# EAGLE schematic ohms-law-1 (EAGLE 7.7.0)
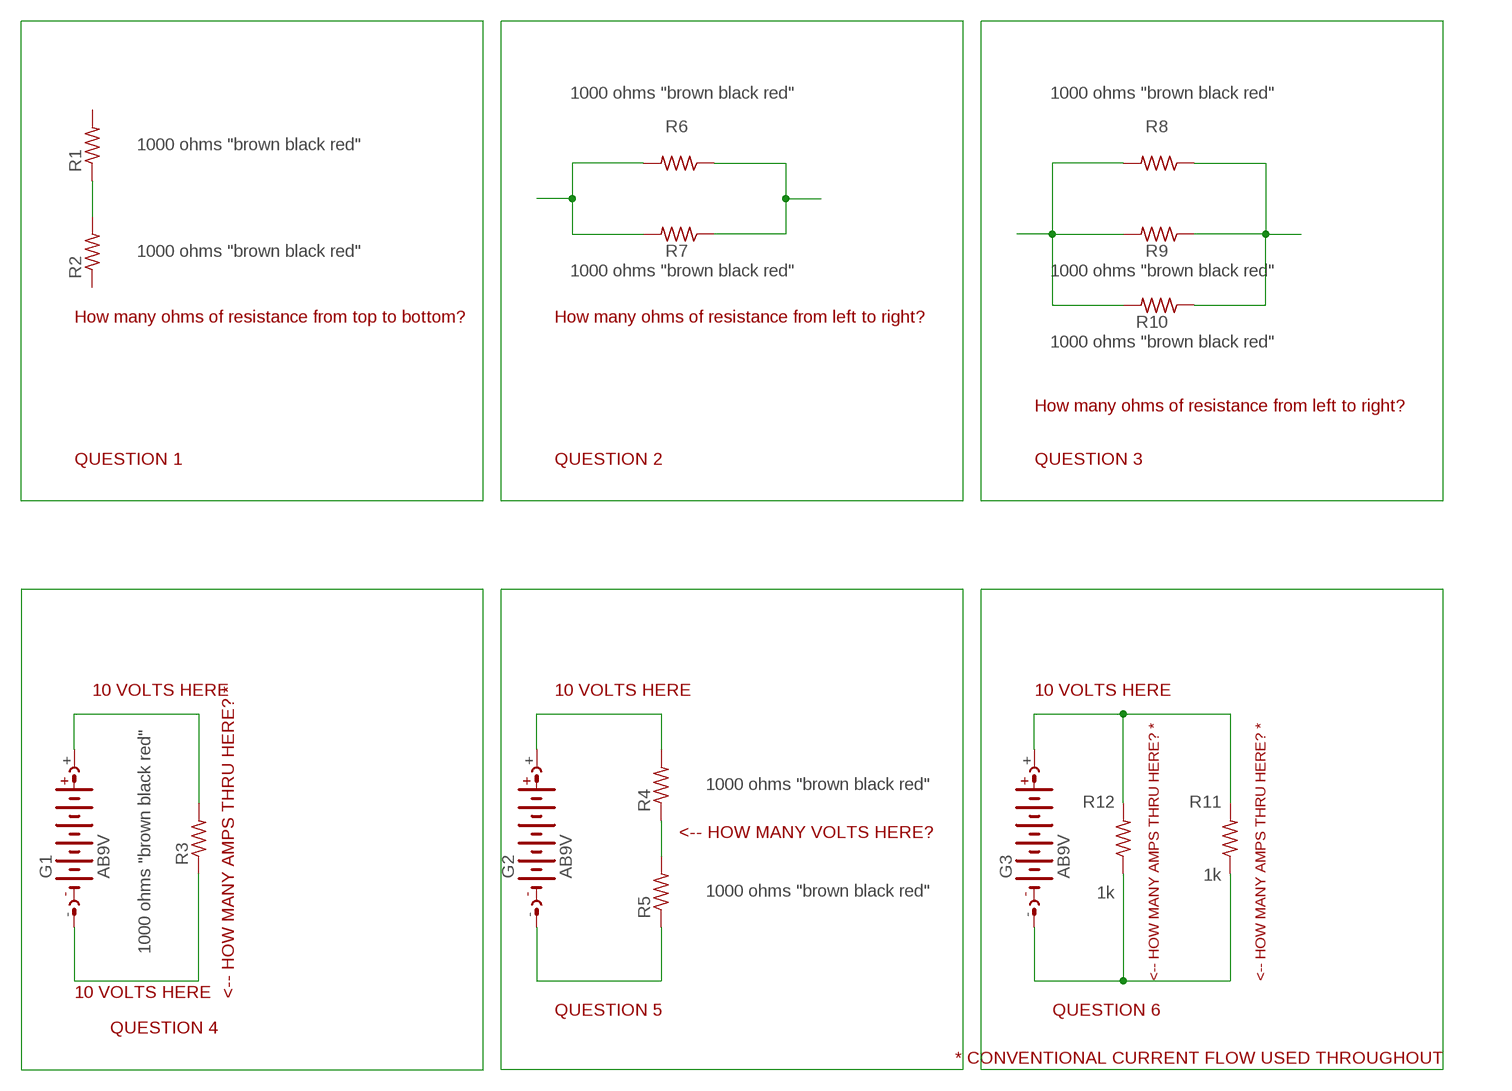
[diagram p0: schematic, sheet 1]

## Parts
G1  AB9V  [AB9V]
G2  AB9V  [AB9V]
G3  AB9V  [AB9V]
R1  1000 ohms "brown black red"  R-US_M0805  [M0805]
R2  1000 ohms "brown black red"  R-US_M0805  [M0805]
R3  1000 ohms "brown black red"  R-US_M0805  [M0805]
R4  1000 ohms "brown black red"  R-US_M0805  [M0805]
R5  1000 ohms "brown black red"  R-US_M0805  [M0805]
R6  1000 ohms "brown black red"  R-US_M0805  [M0805]
R7  1000 ohms "brown black red"  R-US_M0805  [M0805]
R8  1000 ohms "brown black red"  R-US_M0805  [M0805]
R9  1000 ohms "brown black red"  R-US_M0805  [M0805]
R10  1000 ohms "brown black red"  R-US_M0805  [M0805]
R11  1k  R-US_M0805  [M0805]
R12  1k  R-US_M0805  [M0805]

## Nets
N$1: G1.- R3.1
N$2: G1.+ R3.2
N$3: G2.- R5.1
N$4: G2.+ R4.2
N$5: R4.1 R5.2
N$6: G3.- R11.1 R12.1
N$7: G3.+ R11.2 R12.2
N$10: R6.2 R7.2
N$12: R1.1 R2.2
N$14: R6.1 R7.1
N$17: R8.2 R9.2 R10.2
N$18: R8.1 R9.1 R10.1
Unconnected: R1.2 R2.1

## Notes on the sheet
- How many ohms of resistance from top to bottom? | How many ohms of resistance from left to right?
- How many ohms of resistance from left to right?
- QUESTION 1 | QUESTION 2 | QUESTION 3
- 10 VOLTS HERE | 10 VOLTS HERE | 10 VOLTS HERE
- <-- HOW MANY VOLTS HERE?
- <-- HOW MANY AMPS THRU HERE? * | <-- HOW MANY AMPS THRU HERE? *
- 10 VOLTS HERE | <-- HOW MANY AMPS THRU HERE? *
- QUESTION 5 | QUESTION 6
- QUESTION 4
- * CONVENTIONAL CURRENT FLOW USED THROUGHOUT

## Library data of the parts
G1-G3 = battery:AB9V: 9-V BATTERY CLIP
R1-R12 = resistor:R-US_: RESISTOR, American symbol